# EAGLE design controller_02 (EAGLE 9.1.1)
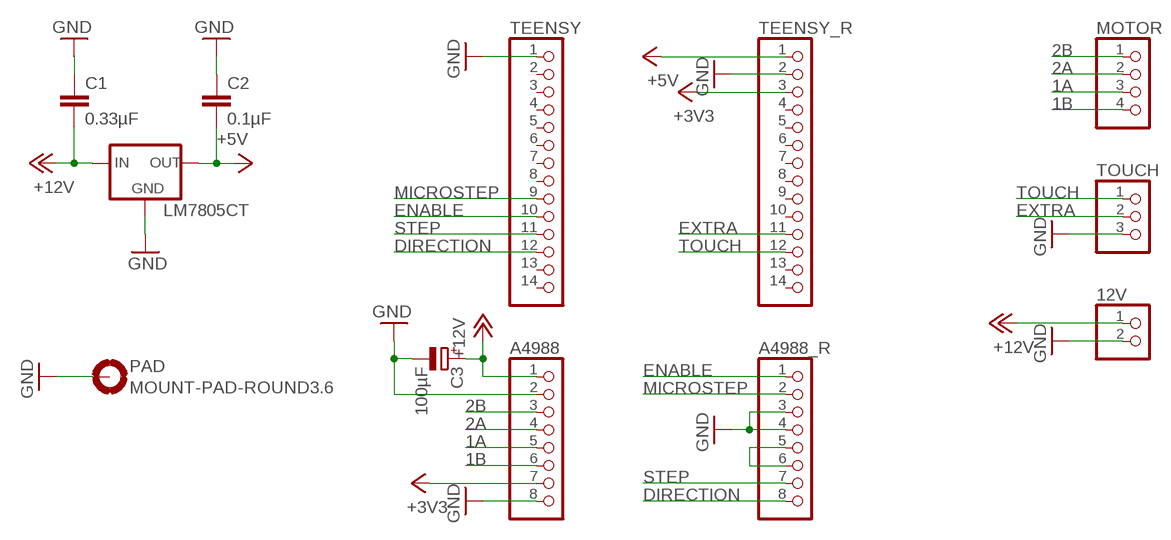
[diagram p0: schematic, sheet 1]

## Parts
12V  PINHD-1X2  [1X02]
A4988  PINHD-1X8  [1X08]
A4988_R  PINHD-1X8  [1X08]
C1  0.33µF  C-EU025-025X050  [C025-025X050]
C2  0.1µF  C-EU025-025X050  [C025-025X050]
C3  100µF  CPOL-EUE3.5-8  [E3,5-8]
LM7805CT  78XXL  [78XXL]
MOTOR  PINHD-1X4  [1X04]
PAD  MOUNT-PAD-ROUND3.6  [3,6-PAD]
TEENSY  PINHD-1X14  [1X14]
TEENSY_R  PINHD-1X14  [1X14]
TOUCH  PINHD-1X3  [1X03]

## Nets
1A: A4988.5 MOTOR.3
1B: A4988.6 MOTOR.4
2A: A4988.4 MOTOR.2
2B: A4988.3 MOTOR.1
+3V3: A4988.7 TEENSY_R.3
+5V: C2.2 LM7805CT.OUT TEENSY_R.1
+12V: 12V.1 A4988.1 C1.2 C3.+ LM7805CT.IN
DIRECTION: A4988_R.8 TEENSY.12
ENABLE: A4988_R.1 TEENSY.10
EXTRA: TEENSY_R.11 TOUCH.2
GND [GND]: 12V.2 A4988.2 A4988.8 A4988_R.3 A4988_R.4 C1.1 C2.1 C3.- LM7805CT.GND PAD.B3,6(MOUNT) TEENSY.1 TEENSY_R.2 TOUCH.3
MICROSTEP: A4988_R.2 TEENSY.9
N$21: A4988_R.5 A4988_R.6
STEP: A4988_R.7 TEENSY.11
TOUCH: TEENSY_R.12 TOUCH.1
Unconnected: TEENSY.2 TEENSY.3 TEENSY.4 TEENSY.5 TEENSY.6 TEENSY.7 TEENSY.8 TEENSY.13 TEENSY.14 TEENSY_R.4 TEENSY_R.5 TEENSY_R.6 TEENSY_R.7 TEENSY_R.8 TEENSY_R.9 TEENSY_R.10 TEENSY_R.13 TEENSY_R.14

## Library data of the parts
12V = pinhead:PINHD-1X2: PIN HEADER
A4988 A4988_R = pinhead:PINHD-1X8: PIN HEADER
C1 C2 = resistor:C-EU: CAPACITOR, European symbol
C3 = resistor:CPOL-EU: POLARIZED CAPACITOR, European symbol
LM7805CT = v-reg:78XXL: VOLTAGE REGULATOR
MOTOR = pinhead:PINHD-1X4: PIN HEADER
PAD = holes:MOUNT-PAD-ROUND: MOUNTING PAD, round
TEENSY TEENSY_R = pinhead:PINHD-1X14: PIN HEADER
TOUCH = pinhead:PINHD-1X3: PIN HEADER

## Net classes
1 GND: width 0.305 mm, clearance 0.305 mm

## Board
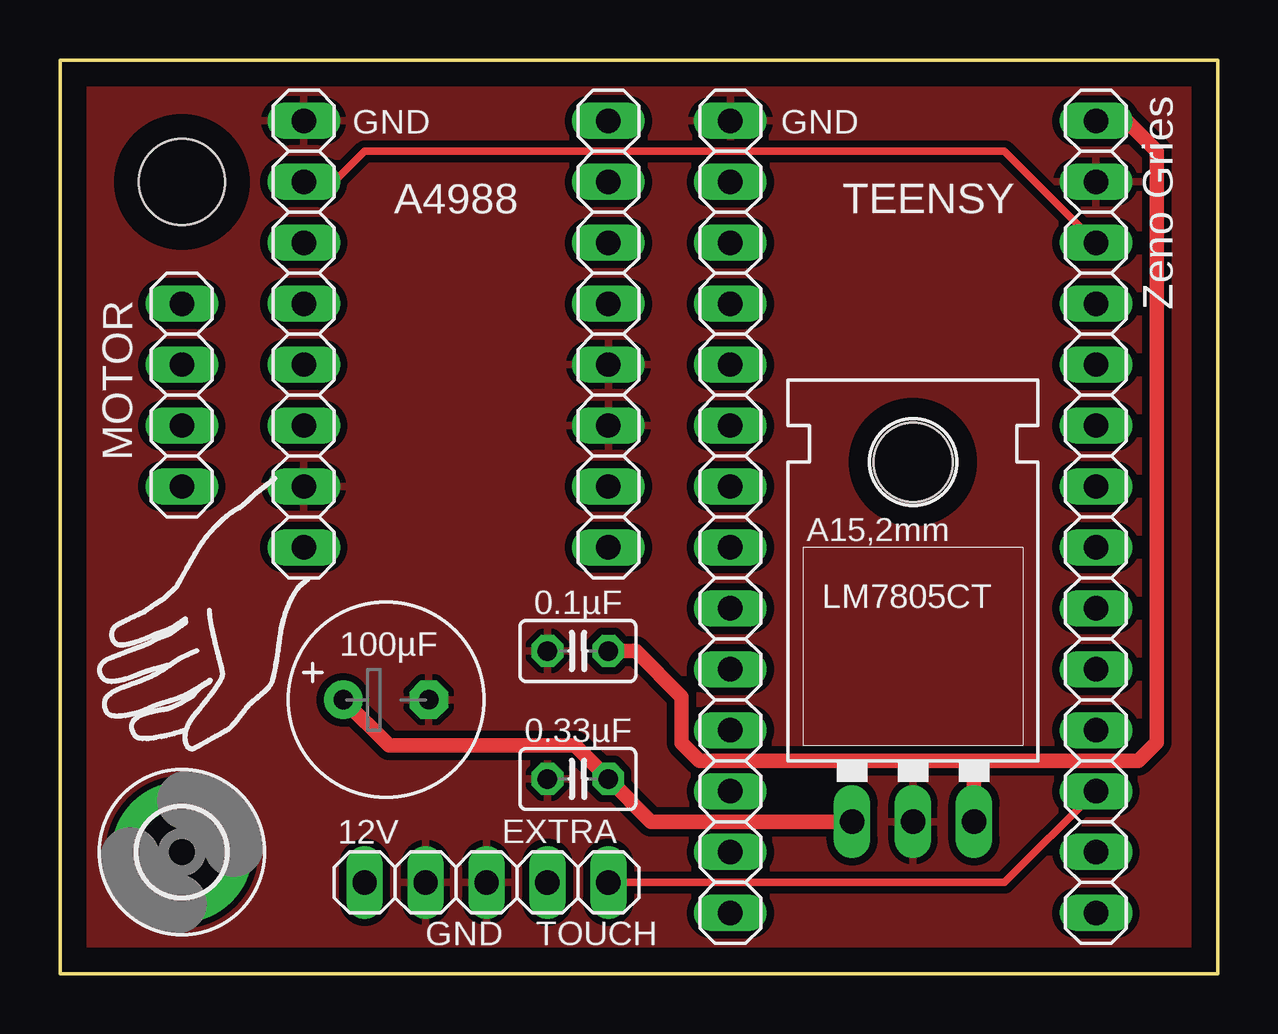
[diagram p1: board, top side]
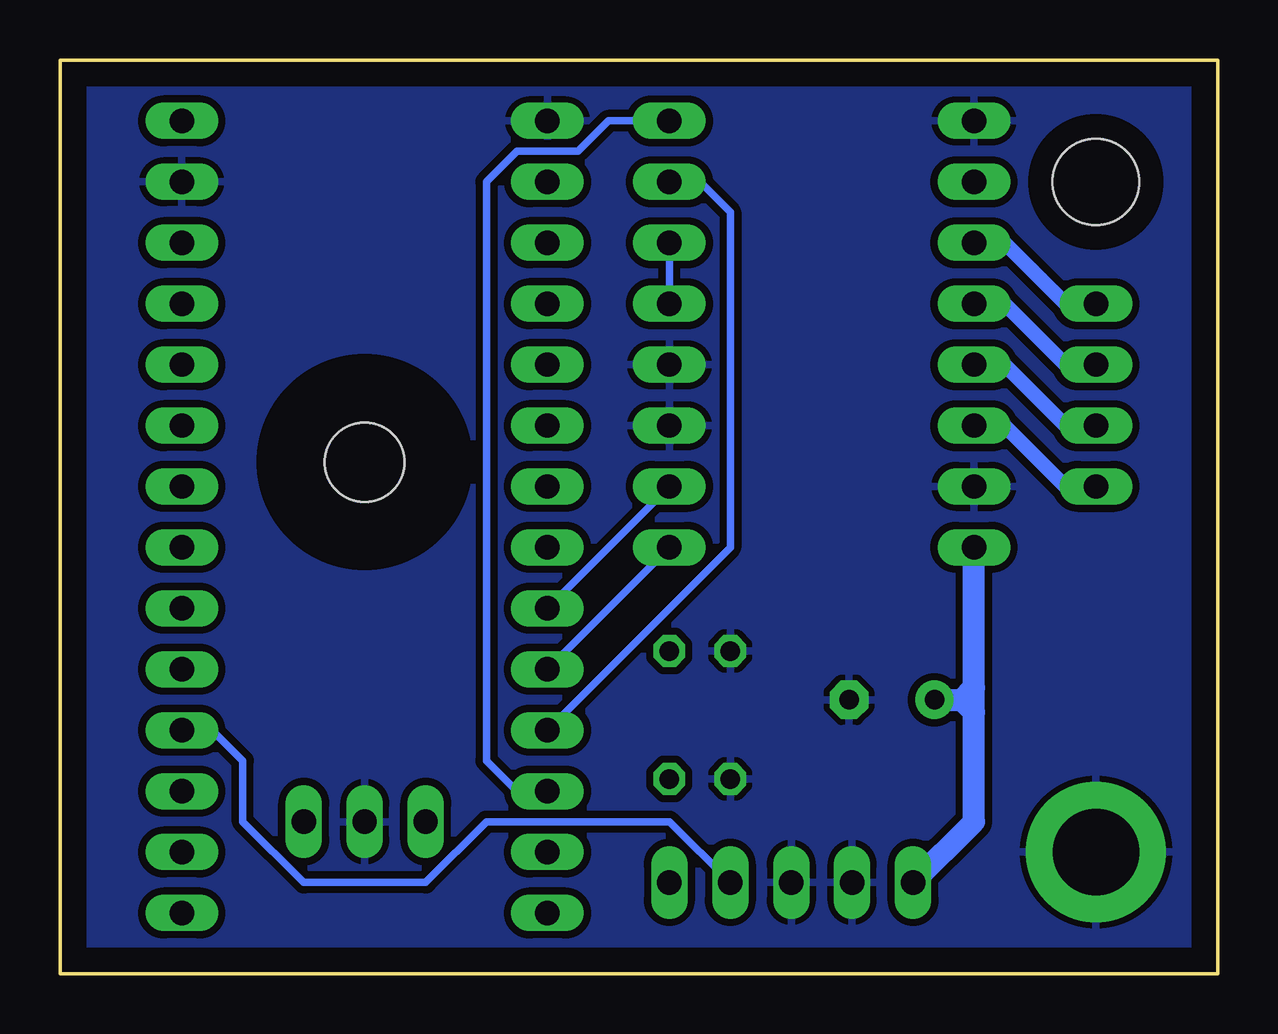
[diagram p2: board, bottom side, seen from below]

Size 48.26 x 38.1 mm. Coordinates in mm from the lower left corner, seen from the top.
Outline: 0,0 0,38.1 48.26,38.1 48.26,0 0,0
Copper layers (1*16): Top 0.035mm / dielectric 1.5mm / Bottom 0.035mm
Design rules "default *": minimum track width 8mil, minimum drill 0.35mm, track to track 8mil, track to pad 8mil, pad to pad 8mil, via to via 8mil, smd to smd 8mil, copper to edge 40mil, drill to drill 8mil, minimum pad ring 10mil, minimum via ring 8mil, stop-mask expansion 4mil, vias tented up to drill 0mil, thermal gap 10mil
Holes 3.6 mm at 5.08,33.02

### Footprints (pad centres in the part's own frame; a part is rotated, then mirrored left to right if it is on the bottom)
1X02 = drill 1.016 long: 1 -1.27,0; 2 1.27,0
1X08 = drill 1.016 long: 1 -8.89,0; 2 -6.35,0; 3 -3.81,0; 4 -1.27,0; 5 1.27,0; 6 3.81,0; 7 6.35,0; 8 8.89,0
C025-025X050 = drill 0.813 octagon: 1 -1.27,0; 2 1.27,0
E3,5-8 = drill 0.813 pad 1.6: + -1.778,0 | drill 0.813 pad 1.6 octagon: - 1.778,0
78XXL = drill 1.016 long: GND 0,-3.81; IN -2.54,-3.81; OUT 2.54,-3.81 | hole 3.302: 0,11.176
1X04 = drill 1.016 long: 1 -3.81,0; 2 -1.27,0; 3 1.27,0; 4 3.81,0
3,6-PAD = drill 3.6 pad 5.842: B3,6 0,0
1X14 = drill 1.016 long: 1 -16.51,0; 2 -13.97,0; 3 -11.43,0; 4 -8.89,0; 5 -6.35,0; 6 -3.81,0; 7 -1.27,0; 8 1.27,0; 9 3.81,0; 10 6.35,0; 11 8.89,0; 12 11.43,0; 13 13.97,0; 14 16.51,0
1X03 = drill 1.016 long: 1 -2.54,0; 2 0,0; 3 2.54,0

### Placement (x,y rotation side)
12V  13.97,3.81 0 top
A4988  10.16,26.67 90 top
A4988_R  22.86,26.67 90 top
C1  21.59,8.13 0 top
C2  21.59,13.46 0 top
C3  13.59,11.43 0 top
LM7805CT  35.56,10.16 0 top
MOTOR  5.08,24.13 90 top
PAD  5.08,5.08 0 top
TEENSY  27.94,19.05 270 top
TEENSY_R  43.18,19.05 270 top
TOUCH  20.32,3.81 180 top

### Tracks (layer width: path | path; a pad name or v marks a point on that pad's centre or on a via)
1A
  Bottom 0.61: MOTOR.3 6.35,25.4 8.89,27.94 A4988.5
1B
  Bottom 0.61: MOTOR.4 6.35,27.94 8.89,30.48 A4988.6
2A
  Bottom 0.61: MOTOR.2 6.35,22.86 8.89,25.4 A4988.4
2B
  Bottom 0.61: MOTOR.1 6.35,20.32 8.89,22.86 A4988.3
+3V3
  Top 0.305: A4988.7 11.43,33.02 12.7,34.29 39.37,34.29 TEENSY_R.3
+5V
  Top 0.61: TEENSY_R.1 44.45,35.56 45.72,34.29 45.72,9.65 44.96,8.89 38.1,8.89 | LM7805CT.OUT 38.1,8.89 | C2.2 24,13.46 25.91,11.56 25.91,9.63 26.65,8.89 38.1,8.89
+12V
  Top 0.61: LM7805CT.IN 24.64,6.35 C1.2 21.46,9.53 13.72,9.53 C3.+
  Bottom 0.914: 10.16,11.94 A4988.1 | 12V.1 10.16,6.35 10.16,10.92 | 10.16,10.92 10.16,11.94 | C3.+ 10.67,11.43 | 10.67,11.43 10.16,11.94 | 10.67,11.43 10.16,10.92
DIRECTION
  Bottom 0.305: A4988_R.8 25.4,35.56 26.67,34.29 29.21,34.29 30.48,33.02 30.48,8.89 29.21,7.62 TEENSY.12
ENABLE
  Bottom 0.305: A4988_R.1 TEENSY.10
EXTRA
  Bottom 0.305: TEENSY_R.11 41.91,10.16 40.64,8.89 40.64,6.35 38.1,3.81 33.02,3.81 30.48,6.35 22.86,6.35 TOUCH.2
GND
  pour Top (isolate 0.305): 0,38.1 0,0 48.26,0 48.26,38.1
  pour Bottom (isolate 0.305): 0,38.1 0,0 48.26,0 48.26,38.1
MICROSTEP
  Bottom 0.305: A4988_R.2 TEENSY.9
N$21
  Bottom 0.305: A4988_R.5 A4988_R.6
STEP
  Bottom 0.305: A4988_R.7 21.59,33.02 20.32,31.75 20.32,17.78 TEENSY.11
TOUCH
  Top 0.305: TEENSY_R.12 39.37,3.81 TOUCH.1

### Text on the board
tNames: GND | GND | Zeno Gries | EXTRA | GND